# Altium schematic sheet chrg_station.SchDoc
size A4
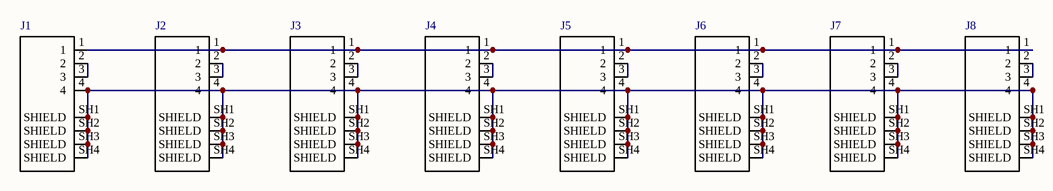
[diagram p0: chrg_station.SchDoc]

## Parts
J1  292336-1  [*TE_292336-1_292336-1(Primary)]  (value not drawn)
J2  292336-1  [*TE_292336-1_292336-1(Primary)]  (value not drawn)
J3  292336-1  [*TE_292336-1_292336-1(Primary)]  (value not drawn)
J4  292336-1  [*TE_292336-1_292336-1(Primary)]  (value not drawn)
J5  292336-1  [*TE_292336-1_292336-1(Primary)]  (value not drawn)
J6  292336-1  [*TE_292336-1_292336-1(Primary)]  (value not drawn)
J7  292336-1  [*TE_292336-1_292336-1(Primary)]  (value not drawn)
J8  292336-1  [*TE_292336-1_292336-1(Primary)]  (value not drawn)

## Nets
NetJ1_1: J1.1 J2.1 J3.1 J4.1 J5.1 J6.1 J7.1 J8.1
NetJ1_2: J1.2 J1.3
NetJ1_4: J1.4 J1.SH1(SHIELD) J1.SH2(SHIELD) J1.SH3(SHIELD) J1.SH4(SHIELD) J2.4 J2.SH1(SHIELD) J2.SH2(SHIELD) J2.SH3(SHIELD) J2.SH4(SHIELD) J3.4 J3.SH1(SHIELD) J3.SH2(SHIELD) J3.SH3(SHIELD) J3.SH4(SHIELD) J4.4 J4.SH1(SHIELD) J4.SH2(SHIELD) J4.SH3(SHIELD) J4.SH4(SHIELD) J5.4 J5.SH1(SHIELD) J5.SH2(SHIELD) J5.SH3(SHIELD) J5.SH4(SHIELD) J6.4 J6.SH1(SHIELD) J6.SH2(SHIELD) J6.SH3(SHIELD) J6.SH4(SHIELD) J7.4 J7.SH1(SHIELD) J7.SH2(SHIELD) J7.SH3(SHIELD) J7.SH4(SHIELD) J8.4 J8.SH1(SHIELD) J8.SH2(SHIELD) J8.SH3(SHIELD) J8.SH4(SHIELD)
NetJ2_2: J2.2 J2.3
NetJ3_2: J3.2 J3.3
NetJ4_2: J4.2 J4.3
NetJ5_2: J5.2 J5.3
NetJ6_2: J6.2 J6.3
NetJ7_2: J7.2 J7.3
NetJ8_2: J8.2 J8.3

## Library data of the parts
J1-J8 = 292336-1: Connector USB Receptacle 4 Position 2mm Solder Right Angle Thru-Hole 4 Terminal 1 Port Tube; MF: TE Connectivity; Package: None; TE_purchase_URL: https://www.te.com/usa-en/product-292336-1.html?te_bu=Cor&te_type=disp&te_campaign=seda_glo_cor-seda-global-disp-prtnr-fy19-seda-model-bom-cta_sma-317_1&elqCampaignId=32493; MP: 292336-1; Availability: Unavailable; SnapEDA_Link: https://www.snapeda.com/parts/292336-1/TE%20Connectivity%20AMP%20Connectors/view-part/?ref=snap; Price: None; Value: *